# Altium schematic sheet connector_3v3 .SchDoc: myA4
size A4; Date: 2018/03/30; DrawnBy: 亓岳鑫; Organization: Altium Limited; Address1: 3 Minna Close; Address2: Belrose; Address3: NSW 2085; Address4: Australia; DocumentNumber: 5; Revision: Alfa 2.0; SheetNumber: 5; SheetTotal: 6; Time: 17:30
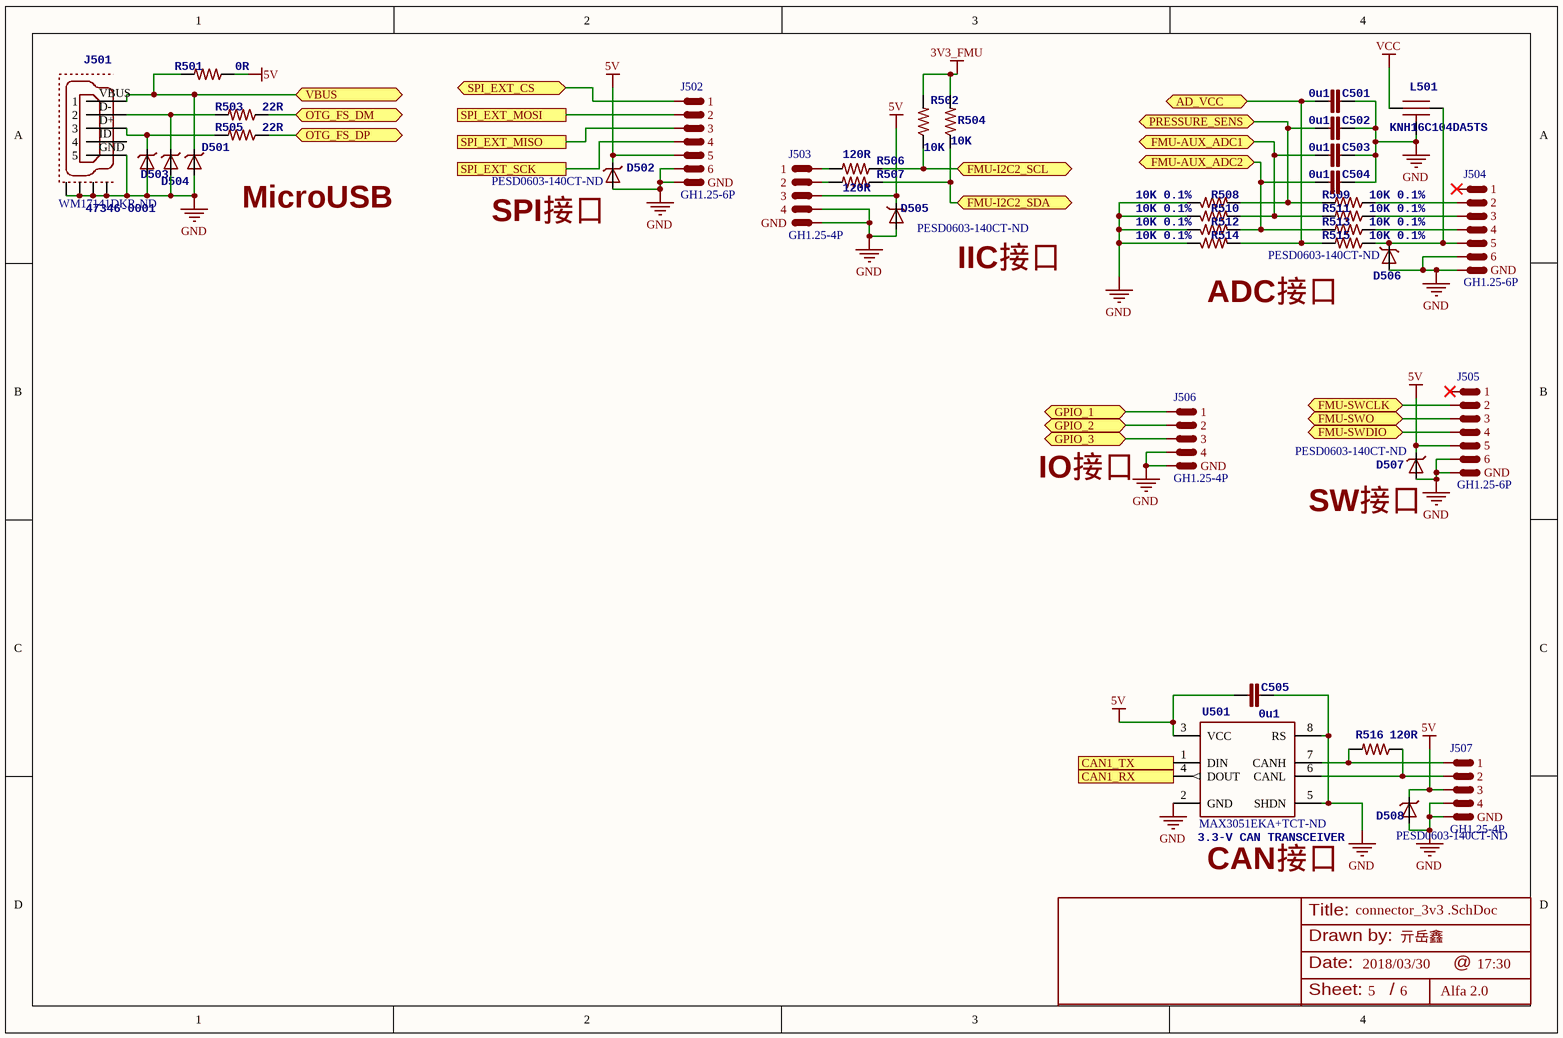
[diagram p0: connector_3v3 .SchDoc]

## Parts
C501  0u1  [0603-CAP]
C502  0u1  [0603-CAP]
C503  0u1  [0603-CAP]
C504  0u1  [0603-CAP]
C505  0u1  [0603-CAP]
D501  PESD0603-140  [0603-ESD]  (value not drawn)
D502  Supplier Part Number 1: PESD0603-140CT-ND  [0603-ESD]  (hidden comment: PESD0603-140)
D503  PESD0603-140  [0603-ESD]  (value not drawn)
D504  PESD0603-140  [0603-ESD]  (value not drawn)
D505  Supplier Part Number 1: PESD0603-140CT-ND  [0603-ESD]  (hidden comment: PESD0603-140)
D506  Supplier Part Number 1: PESD0603-140CT-ND  [0603-ESD]  (hidden comment: PESD0603-140)
D507  Supplier Part Number 1: PESD0603-140CT-ND  [0603-ESD]  (hidden comment: PESD0603-140)
D508  Supplier Part Number 1: PESD0603-140CT-ND  [0603-ESD]  (hidden comment: PESD0603-140)
J501  47346-0001  Supplier Part Number 1: WM17141DKR-ND  [MOLEX-47346-0001]
J502  GH1.25-6P  [1.25-6P]
J503  GH1.25-4P  [1.25-4P]
J504  GH1.25-6P  [1.25-6P]
J505  GH1.25-6P  [1.25-6P]
J506  GH1.25-4P  [1.25-4P]
J507  GH1.25-4P  [1.25-4P]
L501  KNH16C104DA5TS  [0603-KNH16-DA]
R501  0R  [0603-RES]
R502  10K  [0603-RES]
R503  22R  [0603-RES]
R504  10K  [0603-RES]
R505  22R  [0603-RES]
R506  120R  [0603-RES]
R507  120R  [0603-RES]
R508  10K 0.1%  [0603-RES]
R509  10K 0.1%  [0603-RES]
R510  10K 0.1%  [0603-RES]
R511  10K 0.1%  [0603-RES]
R512  10K 0.1%  [0603-RES]
R513  10K 0.1%  [0603-RES]
R514  10K 0.1%  [0603-RES]
R515  10K 0.1%  [0603-RES]
R516  120R  [0603-RES]
U501  3.3-V CAN TRANSCEIVER  Supplier Part Number 1: MAX3051EKA+TCT-ND  [SOT23-8]

## Ports
AD_VCC, CAN1_RX, CAN1_TX, FMU-AUX_ADC1, FMU-AUX_ADC2, FMU-I2C2_SCL, FMU-I2C2_SDA, FMU-SWCLK, FMU-SWDIO, FMU-SWO, GPIO_1, GPIO_2, GPIO_3, OTG_FS_DM, OTG_FS_DP, PRESSURE_SENS, SPI_EXT_CS, SPI_EXT_MISO, SPI_EXT_MOSI, SPI_EXT_SCK, VBUS

## Nets
3V3_FMU: R502.2 R504.2
5V: C505.P$1 D502.C D505.C D507.C D508.C J502.5 J503.3 J505.5 J507.3 R501.1 U501.3(VCC)
GND: C501.P$2 C502.P$2 C503.P$2 C504.P$2 C505.P$2 D501.A D502.A D503.A D504.A D505.A D506.A D507.A D508.A J501.GND(5) J501.GND1 J501.GND2 J501.GND3 J501.GND4 J502.6 J502.GND J503.4 J503.GND J504.6 J504.GND J505.6 J505.GND J506.4 J506.GND J507.4 J507.GND L501.GND R508.1 R510.1 R512.1 R514.1 U501.2(GND) U501.5(SHDN) U501.8(RS)
VCC: L501.P$1
AD_VCC: C501.P$1 R514.2 R515.2 ; port AD_VCC
CAN1_RX: U501.4(DOUT) ; port CAN1_RX
CAN1_TX: U501.1(DIN) ; port CAN1_TX
FMU-AUX_ADC1: C503.P$1 R510.2 R511.2 ; port FMU-AUX_ADC1
FMU-AUX_ADC2: C504.P$1 R512.2 R513.2 ; port FMU-AUX_ADC2
FMU-I2C2_SCL: R502.1 R506.1 ; port FMU-I2C2_SCL
FMU-I2C2_SDA: R504.1 R507.1 ; port FMU-I2C2_SDA
FMU-SWCLK: J505.2 ; port FMU-SWCLK
FMU-SWDIO: J505.4 ; port FMU-SWDIO
FMU-SWO: J505.3 ; port FMU-SWO
GPIO_1: J506.1 ; port GPIO_1
GPIO_2: J506.2 ; port GPIO_2
GPIO_3: J506.3 ; port GPIO_3
OTG_FS_DM: R503.1 ; port OTG_FS_DM
OTG_FS_DP: R505.1 ; port OTG_FS_DP
PRESSURE_SENS: C502.P$1 R508.2 R509.2 ; port PRESSURE_SENS
SPI_EXT_CS: J502.1 ; port SPI_EXT_CS
SPI_EXT_MISO: J502.3 ; port SPI_EXT_MISO
SPI_EXT_MOSI: J502.2 ; port SPI_EXT_MOSI
SPI_EXT_SCK: J502.4 ; port SPI_EXT_SCK
VBUS: D501.C J501.VBUS(1) R501.2 ; port VBUS
NetD503_C: D503.C J501.D+(3) R505.2
NetD504_C: D504.C J501.D-(2) R503.2
NetD506_C: D506.C J504.5 L501.P$2 R515.1
NetJ503_1: J503.1 R506.2
NetJ503_2: J503.2 R507.2
NetJ504_2: J504.2 R509.1
NetJ504_3: J504.3 R511.1
NetJ504_4: J504.4 R513.1
NetJ507_1: J507.1 R516.2 U501.7(CANH)
NetJ507_2: J507.2 R516.1 U501.6(CANL)

Not connected (* = marked no-connect by the designer): J501 ID(4); J504 1*; J505 1*

## Notes on the sheet
- MicroUSB
- (near D502) SPI接口
- IIC接口
- ADC接口
- IO接口
- (near D507) SW接口
- (near U501) CAN接口
- Title:
- Drawn by:
- Date:
- @
- Sheet:
- /

## Library data of the parts
C501-C505 = CAP0603-0.1uF: Capacitor, 0.1uF, 16V, Y5V, 0402, Ceramic; PARTNO: CC0402ZRY5V7BB104; 3DR_PARTNO: ECM0700; Value: 0u1; Supplier 1: Digi-Key; Supplier Part Number 1: 311-1776-1-ND
D501-D508 = DIODE-ESD: TVS DIODE 14V 0603; Supplier 1: Digi-Key
  D501 D503 D504: Supplier Part Number 1: PESD0603-140CT-ND
J501 = MicroUSB: MICRO USB B, BOTTOM MOUNT; 3DR_PARTNO: ECM0486; PARTNO: 0473460001; Supplier 1: Digi-Key
J502 J504 J505 = GH1.25-6P: GH1.25mm 立贴 间距1.25mm 连接器贴片
J503 J506 J507 = GH1.25-4P: GH1.25mm 立贴 间距1.25mm 连接器贴片
L501 = EMI Filters: EMI FILTER CAP 0.1UF 2A 25V 0603; 3DR_PARTNO: ECM0719; Value: 0u1; Supplier 1: Digi-Key; PARTNO: KNH16C104DA5TS
R501 = RES0603-0R: RES 0R OHM 1/10W 5% 0603; Value: 0R; Supplier 1: Digi-Key; Supplier Part Number 1: 311-100DCT-ND
R502 R504 = RES0603-10K: RES 10K OHM 1/10W 5% 0603; Value: 10K; Supplier 1: Digi-Key; Supplier Part Number 1: A126331TR-ND
R503 R505 = RES0603-22R: RES 22R OHM 1/10W 5% 0603; Value: 22R; Supplier 1: Digi-Key; Supplier Part Number 1: 311-220GRCT-ND
R506 R507 R516 = RES0603-120R: RES 120R OHM 1/10W 5% 0603; Value: 120R; Supplier 1: Digi-Key; Supplier Part Number 1: 311-120GRCT-ND
R508-R515 = RES0603-10k_0.1%: RES 10 OHM 1/10W 0.1% 0603; Value: 10K 0.1%; Supplier 1: Digi-Key; Supplier Part Number 1: P10KDBCT-ND
U501 = MAX3051: IC TXRX CAN 1MBPS SOT23-8; 3DR_PARTNO: ECM0831; PARTNO: MAX3051EKA+T; Supplier 1: Digi-Key; Value: CAN